# Altium schematic sheet THB7128步进电机驱动器.SchDoc
size A4
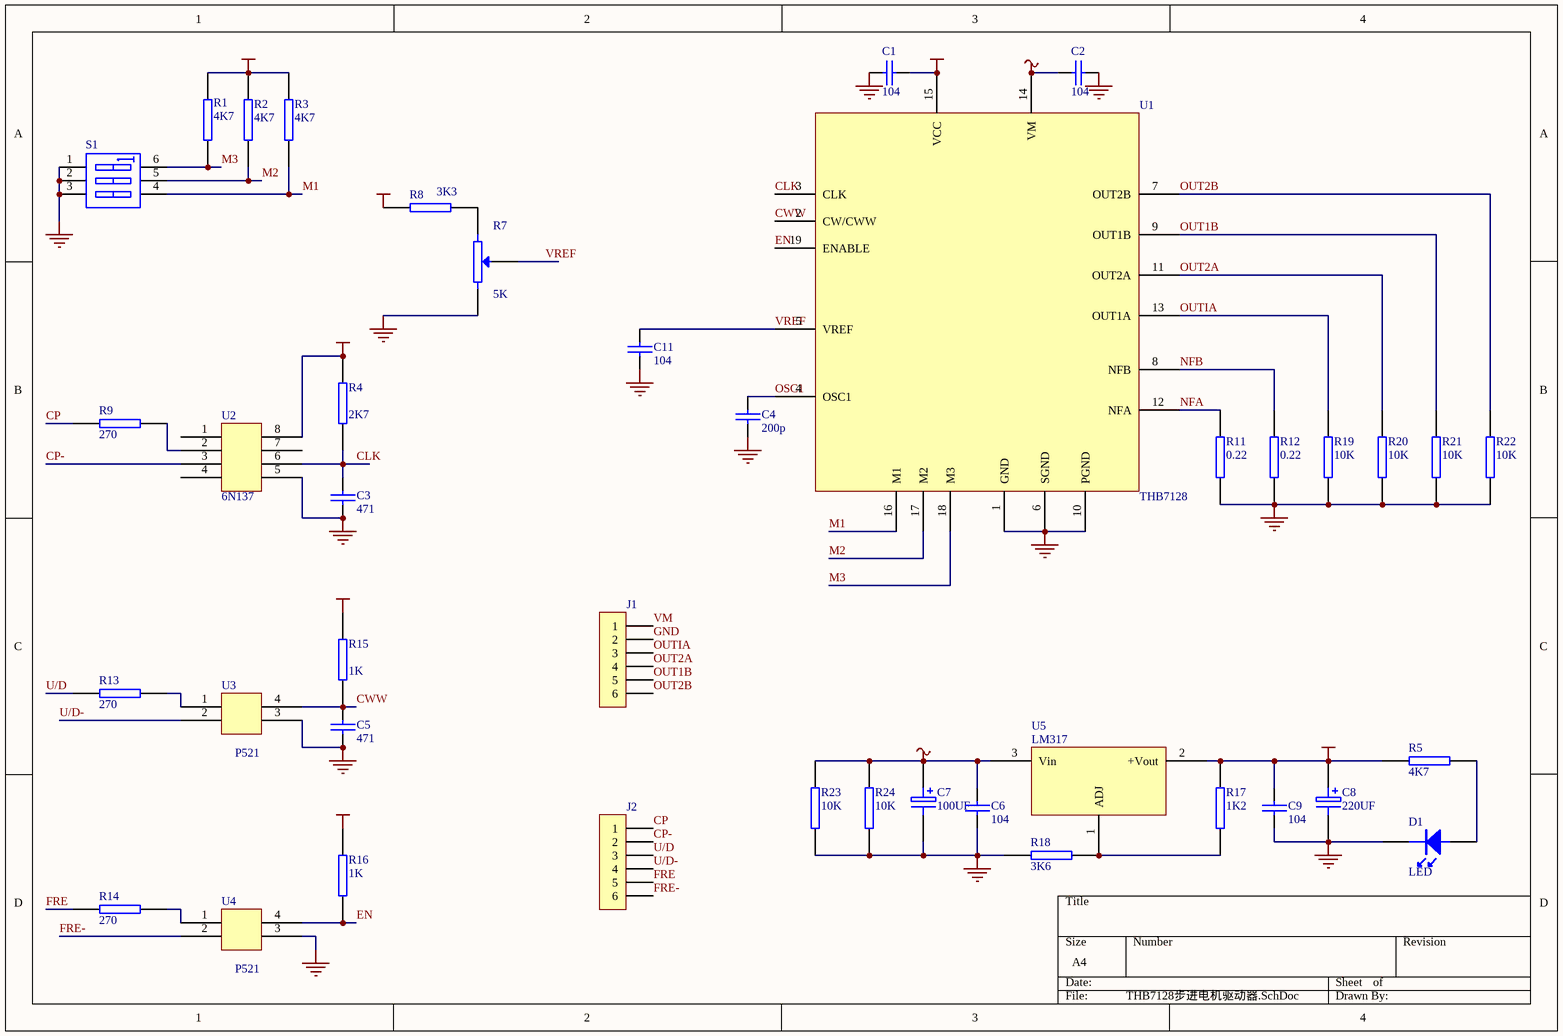
[diagram p0: THB7128步进电机驱动器.SchDoc]

## Parts
C1  104  [0805]
C2  104  [0805]
C3  471  [0805]
C4  200p  [0805]
C5  471  [0805]
C6  104  [0805]
C7  100UF  [C300]
C8  220UF  [C300]
C9  104  [0805]
C11  104  [0805]
D1  LED  [RD]
J1  (no value)  [POW6]
J2  (no value)  [POW6]
R1  4K7  [0805]
R2  4K7  [0805]
R3  4K7  [0805]
R4  2K7  [0805]
R5  4K7  [0805]
R7  5K  [RE]
R8  3K3  [0805]
R9  270  [0805]
R11  0.22  [2512]
R12  0.22  [2512]
R13  270  [0805]
R14  270  [0805]
R15  1K  [0805]
R16  1K  [0805]
R17  1K2  [0805]
R18  3K6  [0805]
R19  10K  [0805]
R20  10K  [0805]
R21  10K  [0805]
R22  10K  [0805]
R23  10K  [0805]
R24  10K  [0805]
S1  (no value)  [DIP6]
U1  THB7128  [ZIP19]
U2  6N137  [DIP8]
U3  P521  [DIP4]
U4  P521  [DIP4]
U5  LM317  [252]

## Nets
GND: C1.1 C2.2 C3.1 C4.2 C5.2 C6.2 C7.2 C8.2 C9.2 C11.2 D1.K J1.2 R7.2 R11.2 R12.2 R18.2 R19.1 R20.1 R21.1 R22.1 R23.1 R24.1 S1.1(A1) S1.2(A2) S1.3(A3) U1.1(GND) U1.6(SGND) U1.10(PGND) U2.5 U3.3 U4.3
VCC: C1.2 C8.1 C9.1 R1.2 R2.2 R3.2 R4.1 R5.2 R8.2 R15.2 R16.2 R17.1 U1.15(VCC) U2.8 U5.2(+Vout)
VM: C2.1 C6.1 C7.1 J1.1 R23.2 R24.2 U1.14(VM) U5.3(Vin)
CLK: C3.2 R4.2 U1.3(CLK) U2.6
CP: J2.1 R9.1
CP-: J2.2 U2.3
CWW: C5.1 R15.1 U1.2(CW/CWW) U3.4
EN: R16.1 U1.19(ENABLE) U4.4
FRE: J2.5 R14.1
FRE-: J2.6 U4.2
M1: R3.1 S1.4(B3) U1.16(M1)
M2: R2.1 S1.5(B2) U1.17(M2)
M3: R1.1 S1.6(B1) U1.18(M3)
NFA: R11.1 U1.12(NFA)
NFB: R12.1 U1.8(NFB)
OSC1: C4.1 U1.4(OSC1)
OUT1B: J1.5 R21.2 U1.9(OUT1B)
OUT2A: J1.4 R20.2 U1.11(OUT2A)
OUT2B: J1.6 R22.2 U1.7(OUT2B)
OUTIA: J1.3 R19.2 U1.13(OUT1A)
U/D: J2.3 R13.1
U/D-: J2.4 U3.2
VREF: C11.1 R7.3(W) U1.5(VREF)
NetD1_A: D1.A R5.1
NetR7_1: R7.1 R8.1
NetR9_2: R9.2 U2.2
NetR13_2: R13.2 U3.1
NetR14_2: R14.2 U4.1
NetR17_2: R17.2 R18.1 U5.1(ADJ)

Not connected (* = marked no-connect by the designer): U2 1 4 7

## Library data of the parts
C1-C6 C9 C11 = CAP: Capacitor
C7 C8 = ELECTRO1: Electrolytic Capacitor
J1 J2 = CON6: Connector
R1-R5 R8 R9 R11-R24 = RES2
R7 = POT2: Potentiometer
S1 = SW DIP-3: DIP Switch
U1 = THB7128-V2
U2 = DIP8
U3 U4 = DIP4
U5 = LM117T